# EAGLE design attiny_temp (EAGLE 9.3.0)
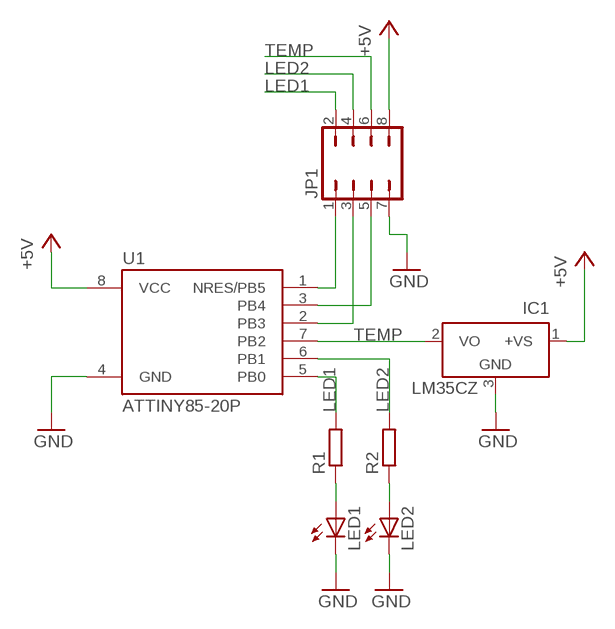
[diagram p0: schematic, sheet 1]

## Parts
IC1  LM35CZ  [TO92]
JP1  JP4Q  [JP4Q]
LED1  LEDCHIPLED_1206  [CHIPLED_1206]
LED2  LEDCHIPLED_1206  [CHIPLED_1206]
R1  R-EU_R1206  [R1206]
R2  R-EU_R1206  [R1206]
U1  ATTINY85-20P  [PDIP08_300MIL]

## Nets
+5V: IC1.1(+VS) JP1.8 U1.8(VCC)
GND: IC1.3(GND) JP1.7 LED1.C LED2.C U1.4(GND)
LED1: JP1.2 R1.2 U1.5(PB0)
LED2: JP1.4 R2.2 U1.6(PB1)
N$4: LED1.A R1.1
N$5: LED2.A R2.1
N$6: JP1.1 U1.1(NRES/PB5)
N$7: JP1.3 U1.2(PB3)
N$8: JP1.5 U1.3(PB4)
TEMP: IC1.2(VO) JP1.6 U1.7(PB2)

## Library data of the parts
IC1 = lm35:LM35: Single-Supply Centigrade Temperature Sensor Vout = (10mV/°C x Temp °C) +5mmmV Source: http://www.national.com/ds/LM/LM35.pdf
JP1 = jumper:JP4Q: JUMPER
LED1 LED2 = adafruit:LED: LED OSRAM: - CHIPLED LG R971, LG N971, LY N971, LG Q971, LY Q971, LO R971, LY R971 LH N974, LH R974 LS Q976, LO Q976, LY Q976 LO Q996 - Hyper CHIPLED LW Q18S LB Q993, LB Q99A, LB R99A - SideLED LS A670, LO A670, LY A670, LG A670, LP A670 LB A673, LV A673, LT A673, LW A673 LH A674 LY A675 LS A676, LA A676, LO A676, LY A676, LW A676 LS A679, LY A679, LG A679 - Hyper Micro SIDELED® LS Y876, LA Y876, LO Y876, LY Y876 LT Y87S - SmartLED LW L88C, LW L88S LB L89C, LB L89S, LG L890 LS L89K, LO L89K, LY L89K LS L896, LA L896, LO L896, LY L896 - TOPLED LS T670, LO T670, LY T670, LG T670, LP T670 LSG T670, LSP T670, LSY T670, LOP T670, LYG T670 LG T671, LOG T671, LSG T671 LB T673, LV T673, LT T673, LW T673 LH T674 LS T676, LA T676, LO T676, LY T676, LB T676, LH T676, LSB T676, LW T676 LB T67C, LV T67C, LT T67C, LS T67K, LO T67K, LY T67K, LW E67C LS E67B, LA E67B, LO E67B, LY E67B, LB E67C, LV E67C, LT E67C LW T67C LS T679, LY T679, LG T679 LS T770, LO T770, LY T770, LG T770, LP T770 LB T773, LV T773, LT T773, LW T773 LH T774 LS E675, LA E675, LY E675, LS T675 LS T776, LA T776, LO T776, LY T776, LB T776 LHGB T686 LT T68C, LB T68C - Hyper Mini TOPLED® LB M676 - Mini TOPLED Santana® LG M470 LS M47K, LO M47K, LY M47K Source: http://www.osram.convergy.de/
R1 R2 = rcl:R-EU_: RESISTOR, European symbol; SPICEPREFIX: R
U1 = attiny25_45_85:ATTINY85*: ATMEL ATtiny 85 Packages: P = PDIP 08 30mil S = SOIC 08 EIAJ 208mil Technologies Note: for complete ordering code (temp. range, finish, tape&reel etc.) see www.atmel.com • Supply Voltage: V = (1.8…5.5)V | [blank] = (2.7…5.5)V • Speed: 10 = 10 MHz | 20 = 20 MHz Author: Dipl.-Ing. FH Rainer Bayer HHN Hochschule Heilbronn (Heilbronn University), rainer.bayer@hs-heilbronn.de Ingenieurbüro ing-rb, mail@ing-rb.de

## Board
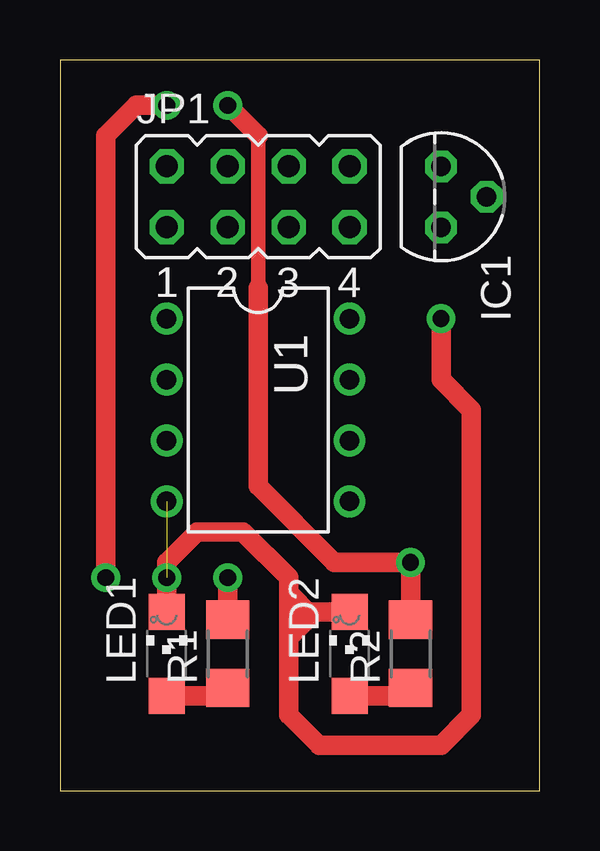
[diagram p1: board, top side]
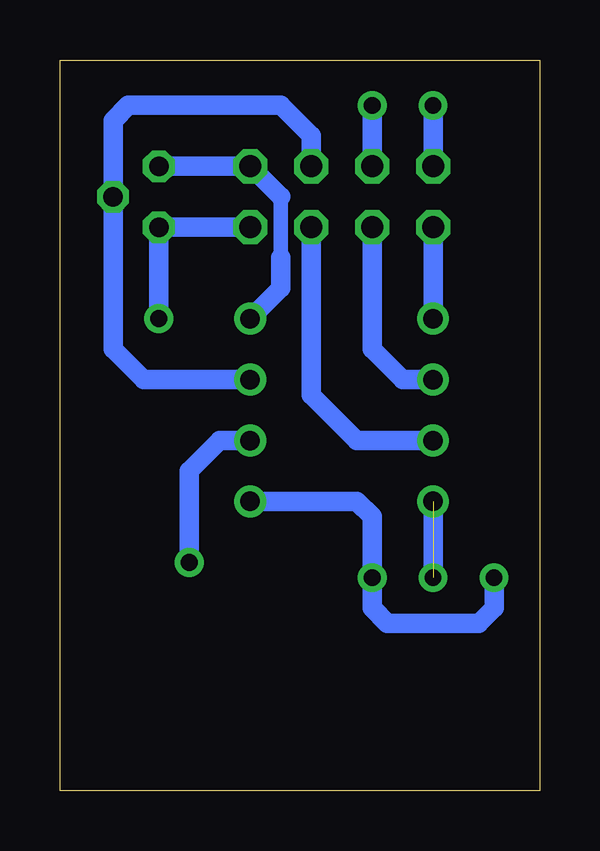
[diagram p2: board, bottom side, seen from below]

Size 19.99 x 30.47 mm. Coordinates in mm from the lower left corner, seen from the top.
Outline: 0,0 19.99,0 19.99,30.47 0,30.47 0,0
Copper layers (1*16): Top 0.035mm / dielectric 1.5mm / Bottom 0.035mm
Design rules "default": minimum track width 6mil, minimum drill 0.35mm, track to track 6mil, track to pad 6mil, pad to pad 6mil, via to via 6mil, smd to smd 6mil, copper to edge 40mil, drill to drill 6mil, minimum pad ring 10mil, minimum via ring 8mil, stop-mask expansion 4mil, vias tented up to drill 0mil, thermal gap 10mil

### Footprints (pad centres in the part's own frame; a part is rotated, then mirrored left to right if it is on the bottom)
TO92 = drill 0.813 octagon: 1 -1.27,0; 2 0,1.905; 3 1.27,0
JP4Q = drill 0.914 octagon: 1 -3.81,-1.27; 2 -3.81,1.27; 3 -1.27,-1.27; 4 -1.27,1.27; 5 1.27,-1.27; 6 1.27,1.27; 7 3.81,-1.27; 8 3.81,1.27
CHIPLED_1206 = smd 1.5 x 1.5: A 0,-1.75; C 0,1.75
R1206 = smd 1.6 x 1.803: 1 -1.422,0; 2 1.422,0
PDIP08_300MIL = drill 0.813: 1 -3.81,-3.81; 2 -1.27,-3.81; 3 1.27,-3.81; 4 3.81,-3.81; 5 3.81,3.81; 6 1.27,3.81; 7 -1.27,3.81; 8 -3.81,3.81

### Placement (x,y rotation side)
IC1  15.88,24.77 270 top
JP1  8.26,24.77 0 top
LED1  4.45,5.71 0 top
LED2  12.06,5.71 0 top
R1  6.99,5.71 90 top
R2  14.61,5.71 90 top
U1  8.26,15.88 270 top

### Tracks (layer width: path | path; a pad name or v marks a point on that pad's centre or on a via)
+5V
  Bottom 0.61: 10.79,24.77 10.79,22.23
  Bottom 0.813: IC1.1 JP1.8 10.79,24.77 | 10.79,22.23 10.79,20.95 U1.8
GND  (via drill 0.7 pad 1.2)  (1 unrouted)
  Top 0.813: 11.59,7.46 LED2.C 9.53,7.46 | LED1.C v4.45,8.89 4.45,9.53 5.71,10.79 7.62,10.79 9.53,8.89 9.53,8.26 | 9.53,8.26 10.48,7.3 9.53,6.35 | 9.53,7.46 9.53,6.35 | 9.53,6.35 9.53,3.17 10.79,1.91 15.88,1.91 17.14,3.17 17.14,15.88 15.88,17.14 v15.88,19.68 | 9.53,8.26 9.53,7.46
  Bottom 0.813: U1.4 v4.45,8.89 | JP1.7 IC1.3 v15.88,19.68
LED1  (via drill 0.7 pad 1.2)
  Top 0.813: R1.2 v6.99,8.89 | v4.45,28.57 3.17,28.57 1.91,27.3 v1.91,8.89
  Bottom 0.813: U1.5 7.62,12.06 6.99,11.43 v6.99,8.89 6.99,7.62 6.35,6.99 2.54,6.99 1.91,7.62 v1.91,8.89 | JP1.2 v4.45,28.57
LED2  (via drill 0.7 pad 1.2)
  Top 0.61: 8.26,27.3 8.26,20.95
  Top 0.813: v6.99,28.57 8.26,27.3 | 8.26,20.95 8.26,12.7 11.43,9.53 v14.61,9.53 R2.2
  Bottom 0.813: U1.6 13.34,14.61 14.61,13.34 v14.61,9.53 | JP1.4 v6.99,28.57
N$4
  Top 0.813: R1.1 6.66,3.96 LED1.A
N$5
  Top 0.813: R2.1 14.28,3.96 LED2.A
N$6
  Bottom 0.813: JP1.1 U1.1
N$7
  Bottom 0.813: U1.2 5.71,17.14 6.99,18.41 JP1.3
N$8
  Bottom 0.813: U1.3 7.62,14.61 9.53,16.51 JP1.5
TEMP
  Bottom 0.813: U1.7 16.51,17.14 17.78,18.41 IC1.2 17.78,27.94 17.14,28.57 10.79,28.57 9.53,27.3 JP1.6